# Altium schematic sheet Power.SchDoc
size A3; SheetNumber: 13; SheetTotal: 13
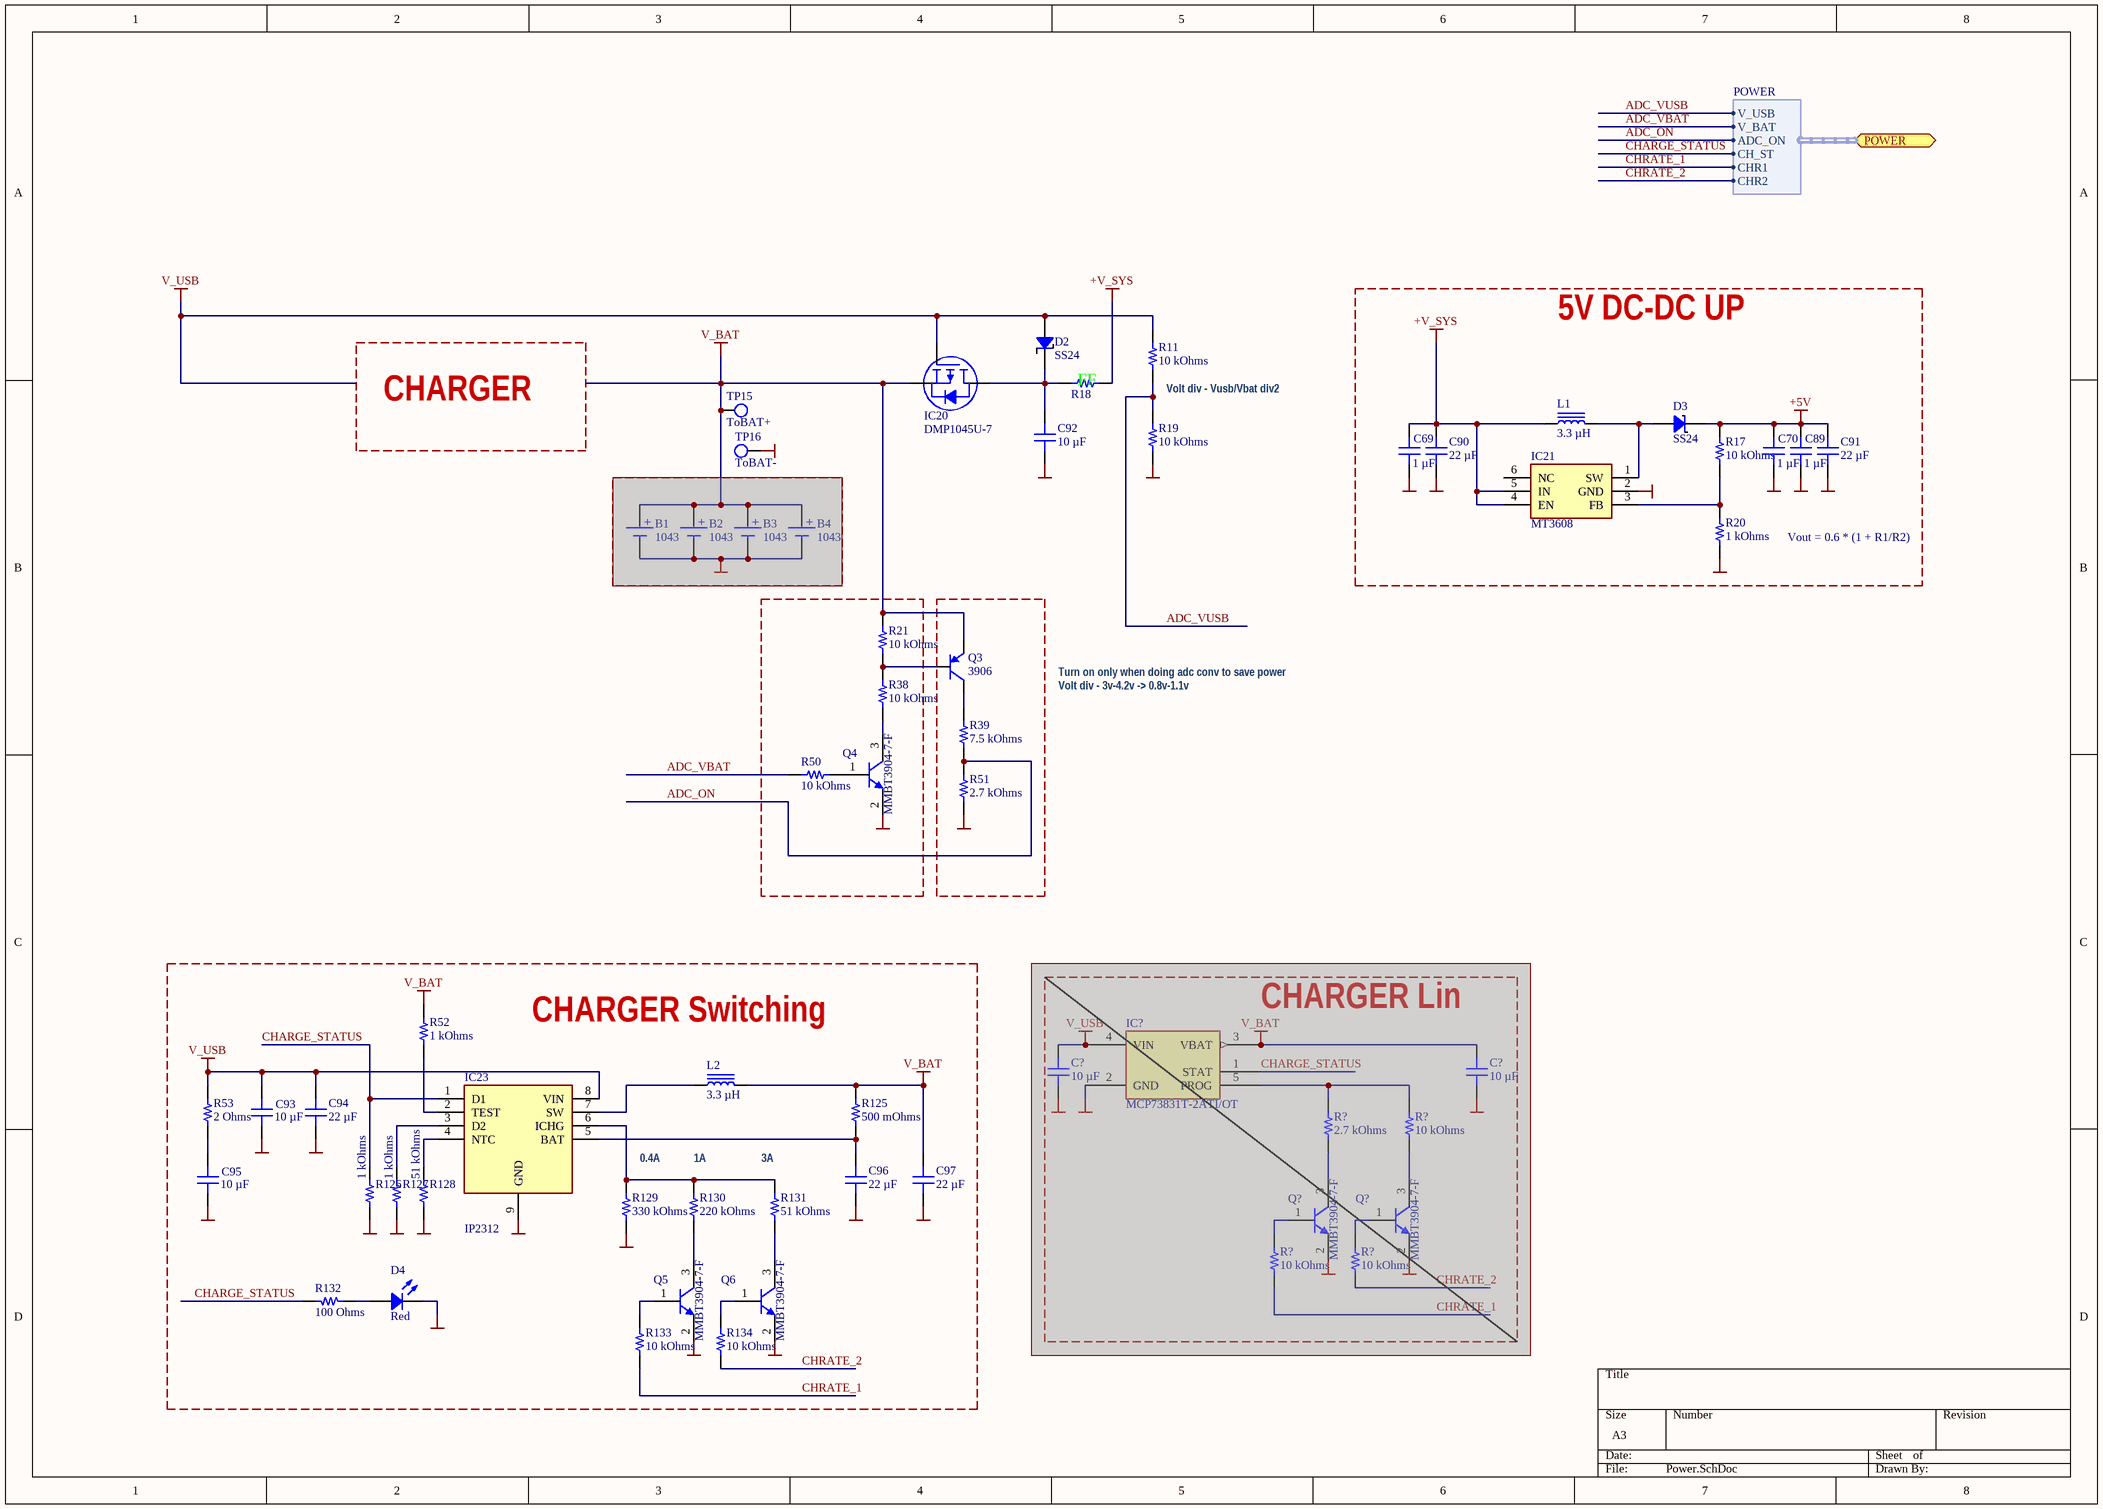
[diagram p0: Power.SchDoc]

## Parts
(Parts that share a designator on the sheet are numbered #1, #2 ... from top to bottom, then left to right.)
B1  1043  [KEYSTONE 1043]  (masked out: inside a compile mask, not in the netlist)
B2  1043  [KEYSTONE 1043]  (masked out: inside a compile mask, not in the netlist)
B3  1043  [KEYSTONE 1043]  (masked out: inside a compile mask, not in the netlist)
B4  1043  [KEYSTONE 1043]  (masked out: inside a compile mask, not in the netlist)
C69  1 µF  [CAP 0805_2012]
C70  1 µF  [CAP 0805_2012]
C89  1 µF  [CAP 0805_2012]
C90  22 µF  [CAP 0805_2012]
C91  22 µF  [CAP 0805_2012]
C92  10 µF  [CAP 0805_2012]
C93  10 µF  [CAP 0805_2012]
C94  22 µF  [CAP 0805_2012]
C95  10 µF  [CAP 0805_2012]
C96  22 µF  [CAP 0805_2012]
C97  22 µF  [CAP 0805_2012]
C?#1  10 µF  [CAP 0805_2012]  (masked out: inside a compile mask, not in the netlist)
C?#2  10 µF  [CAP 0805_2012]  (masked out: inside a compile mask, not in the netlist)
D2  SS24  [DO214AA SMB]
D3  SS24  [DO214AA SMB]
D4  Red  [LED 0805_2012 RED]
IC20  DMP1045U-7  [DIODES SOT-23-3]
IC21  MT3608  [SOT95P280X145-6N]
IC23  IP2312  [SOIC127P600X165-9N]
IC?  MCP73831T-2ATI/OT  [MICROCHIP SOT-23-5 OT]  (masked out: inside a compile mask, not in the netlist)
L1  3.3 µH  [BOURNS SRR6028]
L2  3.3 µH  [BOURNS SRR6028]
Q3  3906  [SOT-23]
Q4  MMBT3904-7-F  [DIODES SOT-23-3]
Q5  MMBT3904-7-F  [DIODES SOT-23-3]
Q6  MMBT3904-7-F  [DIODES SOT-23-3]
Q?#1  MMBT3904-7-F  [DIODES SOT-23-3]  (masked out: inside a compile mask, not in the netlist)
Q?#2  MMBT3904-7-F  [DIODES SOT-23-3]  (masked out: inside a compile mask, not in the netlist)
R11  10 kOhms  [RES 0603_1608]
R17  10 kOhms  [RES 0603_1608]
R18  (no value)  [RES 0603_1608]
R19  10 kOhms  [RES 0603_1608]
R20  1 kOhms  [RES 0603_1608]
R21  10 kOhms  [RES 0603_1608]
R38  10 kOhms  [RES 0603_1608]
R39  7.5 kOhms  [RES 0603_1608]
R50  10 kOhms  [RES 0603_1608]
R51  2.7 kOhms  [RES 0603_1608]
R52  1 kOhms  [RES 0603_1608]
R53  2 Ohms  [RES 0603_1608]
R125  500 mOhms  [RES 0603_1608]
R126  value 1 kOhms  [RES 0603_1608]
R127  1 kOhms  [RES 0603_1608]
R128  51 kOhms  [RES 0603_1608]
R129  330 kOhms  [RES 0603_1608]
R130  220 kOhms  [RES 0603_1608]
R131  51 kOhms  [RES 0603_1608]
R132  100 Ohms  [RES 0402_1005]
R133  10 kOhms  [RES 0603_1608]
R134  10 kOhms  [RES 0603_1608]
R?#1  2.7 kOhms  [RES 0603_1608]  (masked out: inside a compile mask, not in the netlist)
R?#2  10 kOhms  [RES 0603_1608]  (masked out: inside a compile mask, not in the netlist)
R?#3  10 kOhms  [RES 0603_1608]  (masked out: inside a compile mask, not in the netlist)
R?#4  10 kOhms  [RES 0603_1608]  (masked out: inside a compile mask, not in the netlist)
TP15  ToBAT+  [TESTPOINT_PAD]
TP16  ToBAT-  [TESTPOINT_PAD]

## Blocks framed on the sheet
5V DC-DC UP: C69 C70 C89-C91 D3 IC21 L1 R17 R20
CHARGER Switching: C93-C97 D4 IC23 L2 Q5 Q6 R52 R53 R125-R134
CHARGER Lin: C?#1 C?#2 IC? Q?#1 Q?#2 R?#1-R?#4

## Ports
POWER (bidir, harness POWER)

## Harnesses
POWER: V_USB, V_BAT, ADC_ON, CH_ST, CHR1, CHR2

## Nets
+5V: C70.2 C89.2 C91.2 D3.2 R17.2
+V_SYS: C69.2 C90.2 IC21.4(EN) IC21.5(IN) L1.1 R18.1
GND: C69.1 C70.1 C89.1 C90.1 C91.1 C92.1 C93.1 C94.1 C95.1 C96.1 C97.1 D4.2 IC21.2(GND) IC23.9(GND) Q4.2(E) Q5.2(E) Q6.2(E) R19.1 R20.1 R51.1 R126.2 R127.2 R128.1 R129.1 TP16.1
V_BAT: C97.2 IC20.2(S) L2.2 Q3.2(E) R21.2 R52.2 R125.2 TP15.1
V_USB: C93.2 C94.2 D2.1 IC20.1(G) IC23.8(VIN) R11.2 R53.2
ADC_ON: R39.1 R51.2 ; port POWER.ADC_ON
ADC_VBAT: R50.2 ; port POWER.V_BAT
ADC_VUSB: R11.1 R19.2 ; port POWER.V_USB
CHARGE_STATUS: IC23.1(D1) R126.1 R132.2 ; port POWER.CH_ST
CHRATE_1: R133.1 ; port POWER.CHR1
CHRATE_2: R134.1 ; port POWER.CHR2
NetC92_2: C92.2 D2.2 IC20.3(D) R18.2
NetC95_2: C95.2 R53.1
NetC96_2: C96.2 IC23.5(BAT) R125.1
NetD3_1: D3.1 IC21.1(SW) L1.2
NetD4_1: D4.1 R132.1
NetIC21_3: IC21.3(FB) R17.1 R20.2
NetIC23_2: IC23.2(TEST) R52.1
NetIC23_3: IC23.3(D2) R127.1
NetIC23_4: IC23.4(NTC) R128.2
NetIC23_6: IC23.6(ICHG) R129.2 R130.2 R131.2
NetIC23_7: IC23.7(SW) L2.1
NetQ3_1: Q3.1(B) R21.1 R38.2
NetQ3_3: Q3.3(C) R39.2
NetQ4_1: Q4.1(B) R50.1
NetQ4_3: Q4.3(C) R38.1
NetQ5_1: Q5.1(B) R133.2
NetQ5_3: Q5.3(C) R130.1
NetQ6_1: Q6.1(B) R134.2
NetQ6_3: Q6.3(C) R131.1

Not connected (* = marked no-connect by the designer): IC21 6(NC)

## Notes on the sheet
- CHARGER
- (near R18) FF
- Volt div - Vusb/Vbat div2
- Vout = 0.6 * (1 + R1/R2)
- Turn on only when doing adc conv to save power
- Volt div - 3v-4.2v -> 0.8v-1.1v
- 0.4A
- (near R130) 1A
- (near R131) 3A

## Library data of the parts
B1-B4 = 1043: BATTERY HOLDER 18650 PC PIN; Manufacturer: Keystone Electronics; Battery Cell Size: 18650; Battery Type, Function: Cylindrical, Holder; Number of Cells: 1; Style: Holder (Open); Part Number: 1043; ComponentLink1Description: Datasheet; ComponentLink1URL: http://keyelco.com/userAssets/file/M65p27.pdf; ComponentLink2Description: DigiKey Link; ComponentLink2URL: http://digikey.com/product-detail/en/keystone-electronics/1043/36-1043-ND/2745669; Height Above Board: 0.585" (14.86mm); LastUpdated: 2/2/2020 9:19:56 AM; Lifecycle Status: Active; Minimum Order: 1; Mounting Type: PCB, Through Hole; Operating Temperature: -50°C ~ 145°C; Packaging: Unknown; PartId: 2; Part Status: Active; Price: 2.58; Series: -; Supplier 1: DigiKey; Supplier Part Number 1: 36-1043-ND; Termination Style: PC Pin
C69 C70 C89 = C0805C105K4RAC7800: CAP CER 1UF 16V X7R 0805; manufacturer: KEMET; Tolerance: ±10%; Part Number: C0805C105K4RAC7800; Value: 1 µF; Applications: Bypass, Decoupling; Capacitance: 1 µF; componentlink1description: Datasheet; componentlink1url: https://api.kemet.com/component-edge/download/datasheet/C0805C105K4RACTU.pdf; componentlink2description: DigiKey Link; componentlink2url: https://www.digikey.com/en/products/detail/kemet/C0805C105K4RAC7800/416047; Device Package: 0805 (2012 Metric); lastupdated: 9/19/2022 1:03:30 PM; Lifecycle Status: Active; Minimum Order: 1; Mounting Type: Surface Mount, MLCC; Operating Temperature: -55°C ~ 125°C; Package / Case: 0805 (2012 Metric); packaging: TapeAndReel; partid: 32075; Part Status: Active; price: 0.01; series: SMD Comm X7R; Size / Dimension: 0.079" L x 0.049" W (2.00mm x 1.25mm); Supplier 1: DigiKey; Supplier Part Number 1: 399-C0805C105K4RAC7800CT-ND; Temperature Coefficient: X7R; Thickness (Max): 0.039" (1.00mm); Voltage - Rated: 16V
C90 C91 C94 C96 C97 = CC0805MKX5R8BB226: CAP CER 22UF 25V X5R 0805; manufacturer: Yageo; Tolerance: ±20%; Part Number: CC0805MKX5R8BB226; Value: 22 µF; Applications: General Purpose; Capacitance: 22 µF; componentlink1description: Datasheet; componentlink1url: https://www.yageo.com/upload/media/product/productsearch/datasheet/mlcc/UPY-GPHC_X5R_4V-to-50V_25.pdf; componentlink2description: DigiKey Link; componentlink2url: https://www.digikey.com/en/products/detail/yageo/CC0805MKX5R8BB226/5195309; Device Package: 0805 (2012 Metric); lastupdated: 2/9/2024 8:15:14 PM; Lifecycle Status: Active; Minimum Order: 1; Mounting Type: Surface Mount, MLCC; Operating Temperature: -55°C ~ 85°C; Package / Case: 0805 (2012 Metric); packaging: TapeAndReel; partid: 39226; Part Status: Active; price: 0.09; series: CC; Size / Dimension: 0.079" L x 0.049" W (2.00mm x 1.25mm); Supplier 1: DigiKey; Supplier Part Number 1: 311-1903-1-ND; Temperature Coefficient: X5R; Thickness (Max): 0.057" (1.45mm); Voltage - Rated: 25V
C92 C93 C95 C?#1 C?#2 = C0805C106K8PAC7800: CAP CER 10UF 10V X5R 0805; manufacturer: KEMET; Tolerance: ±10%; Part Number: C0805C106K8PAC7800; Value: 10 µF; Applications: Bypass, Decoupling; Capacitance: 10 µF; componentlink1description: Datasheet; componentlink1url: https://connect.kemet.com:7667/gateway/IntelliData-ComponentDocumentation/1.0/download/datasheet/C0805C106K8PACTU; componentlink2description: DigiKey Link; componentlink2url: https://www.digikey.com/en/products/detail/kemet/C0805C106K8PAC7800/1090830; Device Package: 0805 (2012 Metric); lastupdated: 9/14/2022 7:51:56 AM; Lifecycle Status: Active; Minimum Order: 1; Mounting Type: Surface Mount, MLCC; Operating Temperature: -55°C ~ 85°C; Package / Case: 0805 (2012 Metric); packaging: TapeAndReel; partid: 44790; Part Status: Active; price: 0.02; series: SMD Comm X5R; Size / Dimension: 0.079" L x 0.049" W (2.00mm x 1.25mm); Supplier 1: DigiKey; Supplier Part Number 1: 399-C0805C106K8PAC7800CT-ND; Temperature Coefficient: X5R; Thickness (Max): 0.055" (1.40mm); Voltage - Rated: 10V
D2 D3 = SS24: DIODE SCHOTTKY 40V 2A DO214AA; Manufacturer: ON Semiconductor; Current - Reverse Leakage @ Vr: 400µA @ 40V; Speed: Fast Recovery =< 500ns, > 200mA (Io); Voltage - Forward (Vf) (Max) @ If: 500mV @ 2A; Part Number: SS24; ComponentLink1Description: Datasheet; ComponentLink1URL: https://www.onsemi.com/pub/Collateral/SS29-D.pdf; ComponentLink2Description: DigiKey Link; ComponentLink2URL: http://digikey.com/product-detail/en/on-semiconductor/SS24/SS24FSCT-ND/1626273; Current - Average Rectified (Io): 2A; Diode Type: Schottky; LastUpdated: 2/8/2024 9:26:46 PM; Lifecycle Status: Active; Minimum Order: 1; Mounting Type: Surface Mount; Operating Temperature - Junction: -65°C ~ 125°C; Package / Case: DO-214AA, SMB; Packaging: TapeAndReel; PartId: 1394; Part Status: Active; Price: 0.10; Series: -; Supplier 1: DigiKey; Supplier Part Number 1: SS24FSCT-ND; Supplier Device Package: DO-214AA (SMB); Voltage - DC Reverse (Vr) (Max): 40V
D4 = LSM0805412V: LED RED CLEAR 0805 SMD; Manufacturer: Visual Communications Company - VCC; Configuration: 0805; Current - Test: 20mA; Lens Color: Colorless; Lens Size: 1.40mm x 1.20mm; Lens Style: Rectangle with Flat Top; Millicandela Rating: 100mcd; Viewing Angle: 120°; Voltage - Forward (Vf) (Typ): 2V; Wavelength - Dominant: 625nm; Part Number: LSM0805412V; Color: Red; ComponentLink1Description: Datasheet; ComponentLink1URL: https://www.vcclite.com/wp-content/uploads/wpallimport/files/files/LSM0805452V-Green-Datasheet.pdf; ComponentLink2Description: DigiKey Link; ComponentLink2URL: https://www.digikey.com/en/products/detail/visual-communications-company-vcc/LSM0805412V/10229616; Device Package: 0805 (2012 Metric); Height (Max): 0.90mm; LastUpdated: 6/3/2024 8:00:06 PM; Lens Transparency: Clear; Lifecycle Status: Active; Minimum Order: 1; Mounting Type: Surface Mount; Package / Case: 0805 (2012 Metric); Packaging: TapeAndReel; PartId: 336; Part Status: Active; Price: 0.11; Series: LSM0805; Size / Dimension: 2.00mm L x 1.25mm W; Supplier 1: DigiKey; Supplier Part Number 1: 28-LSM0805412VCT-ND; Supplier Device Package: 0805; Value: Red; Wavelength - Peak: 625nm
IC20 = DMP1045U-7: MOSFET P-CH 12V 4A SOT23; Manufacturer: Diodes Incorporated; Current - Continuous Drain (Id) @ 25°C: 4A (Ta); Drive Voltage (Max Rds On,  Min Rds On): 1.8V, 4.5V; FET Type: P-Channel; Gate Charge (Qg) (Max) @ Vgs: 15.8 nC @ 4.5 V; Input Capacitance (Ciss) (Max) @ Vds: 1357 pF @ 10 V; Power Dissipation (Max): 800mW (Ta); Rds On (Max) @ Id, Vgs: 31mOhm @ 4A, 4.5V; Vgs (Max): ±8V; Vgs(th) (Max) @ Id: 1V @ 250µA; Part Number: DMP1045U-7; ComponentLink1Description: Datasheet; ComponentLink1URL: https://www.diodes.com/assets/Datasheets/DMP1045U.pdf; ComponentLink2Description: DigiKey Link; ComponentLink2URL: https://www.digikey.com/en/products/detail/diodes-incorporated/DMP1045U-7/4249936; Drain to Source Voltage (Vdss): 12 V; LastUpdated: 2/8/2024 9:46:13 PM; Lifecycle Status: Active; Minimum Order: 1; Mounting Type: Surface Mount; Operating Temperature: -55°C ~ 150°C (TJ); Package / Case: TO-236-3, SC-59, SOT-23-3; Packaging: TapeAndReel; Part Status: Active; Price: 0.07; Series: -; Supplier 1: DigiKey; Supplier Part Number 1: DMP1045U-7DICT-ND; Supplier Device Package: SOT-23-3; Technology: MOSFET (Metal Oxide)
IC21 = MT3608: Integrated Circuit; Manufacturer_Name: Aerosemi; Datasheet Link: https://www.olimex.com/Products/Breadboarding/BB-PWR-3608/resources/MT3608.pdf; Height: 1.45mm; Manufacturer_Part_Number: MT3608
IC23 = IP2312: Integrated Circuit; Manufacturer_Name: INJOINIC; Datasheet Link: http://www.injoinic.com/wwwroot/uploads/files/20230913/623558e526750db62e25e32800f94a6b.pdf; Height: 1.65mm; Manufacturer_Part_Number: IP2312
IC? = MCP73831T-2ATI/OT: IC CONTROLLR LI-ION 4.2V SOT23-5; Manufacturer: Microchip Technology; Battery Chemistry: Lithium Ion/Polymer; Charge Current - Max: 500mA; Current - Charging: Constant - Programmable; Fault Protection: Over Voltage; Number of Cells: 1; Programmable Features: Current; Voltage - Supply (Max): 6V; Part Number: MCP73831T-2ATI/OT; Battery Pack Voltage: 4.2V; ComponentLink1Description: Datasheet; ComponentLink1URL: http://ww1.microchip.com/downloads/en/DeviceDoc/20001984g.pdf; ComponentLink2Description: DigiKey Link; ComponentLink2URL: //digikey.com/product-detail/en/microchip-technology/MCP73831T-2ATI-OT/MCP73831T-2ATI-OTTR-ND/964303; Device Package: SC-74A, SOT-753; LastUpdated: 12/3/2019 11:33:03 PM; Lifecycle Status: 0; Minimum Order: 1; Mounting Type: Surface Mount; Operating Temperature: -40°C ~ 85°C (TA); Package / Case: SC-74A, SOT-753; Packaging: TapeAndReel; PartId: 1; Part Status: Active; Price: 0.42; Series: -; Supplier 1: DigiKey; Supplier Part Number 1: MCP73831T-2ATI/OTTR-ND; Supplier Device Package: SOT-23-5
L1 L2 = SRR6028-3R3Y: FIXED IND 3.3UH 2.5A 28 MOHM SMD; Manufacturer: Bourns Inc.; Current - Saturation: 2.6A; DC Resistance (DCR): 28mOhm Max; Frequency - Self Resonant: 45MHz; Inductance Frequency - Test: 100 kHz; Material - Core: Ferrite; Q @ Freq: 10 @ 7.96MHz; Shielding: Shielded; Tolerance: ±30%; Type: Drum Core, Wirewound; Part Number: SRR6028-3R3Y; ComponentLink1Description: Datasheet; ComponentLink1URL: https://www.bourns.com/docs/Product-Datasheets/SRR6028.pdf; ComponentLink2Description: DigiKey Link; ComponentLink2URL: https://www.digikey.com/en/products/detail/bourns-inc/SRR6028-3R3Y/1970369; Current Rating (Amps): 2.5 A; Device Package: Nonstandard; Height - Seated (Max): 0.118" (3.00mm); Inductance: 3.3 µH; LastUpdated: 2/8/2024 9:34:55 PM; Lifecycle Status: Active; Minimum Order: 1; Mounting Type: Surface Mount; Operating Temperature: -40°C ~ 125°C; Package / Case: Nonstandard; Packaging: TapeAndReel; PartId: 57; Part Status: Active; Price: 0.31; Series: SRR6028; Size / Dimension: 0.268" L x 0.268" W (6.80mm x 6.80mm); Supplier 1: DigiKey; Supplier Part Number 1: 118-SRR6028-3R3YCT-ND; Value: 3.3 µH
Q3 = MMBT3906
Q4-Q6 Q?#1 Q?#2 = MMBT3904-7-F: TRANS NPN 40V 0.2A SOT23-3; Manufacturer: Diodes Incorporated; Current - Collector Cutoff (Max): 50nA (ICBO); Current - Collector (Ic) (Max): 200 mA; DC Current Gain (hFE) (Min) @ Ic, Vce: 100 @ 10mA, 1V; Frequency - Transition: 300MHz; Power - Max: 300 mW; Vce Saturation (Max) @ Ib, Ic: 300mV @ 5mA, 50mA; Part Number: MMBT3904-7-F; ComponentLink1Description: Datasheet; ComponentLink1URL: https://www.diodes.com/assets/Datasheets/ds30036.pdf; ComponentLink2Description: DigiKey Link; ComponentLink2URL: https://www.digikey.com/en/products/detail/diodes-incorporated/MMBT3904-7-F/814494; LastUpdated: 2/8/2024 9:54:04 PM; Lifecycle Status: Active; Minimum Order: 1; Mounting Type: Surface Mount; Operating Temperature: -55°C ~ 150°C (TJ); Package / Case: TO-236-3, SC-59, SOT-23-3; Packaging: TapeAndReel; PartId: 85; Part Status: Active; Price: 0.01; Series: -; Supplier 1: DigiKey; Supplier Part Number 1: MMBT3904-FDICT-ND; Supplier Device Package: SOT-23-3; Transistor Type: NPN; Voltage - Collector Emitter Breakdown (Max): 40 V
R11 R17 R19 R21 R38 R50 R133 R134 = ERJ-3EKF1002V: RES SMD 10K OHM 1% 1/10W 0603; Manufacturer: Panasonic Electronic Components; Power (Watts): 0.1W, 1/10W; Temperature Coefficient: ±100ppm/°C; Part Number: ERJ-3EKF1002V; Value: 10 kOhms; ComponentLink1Description: Datasheet; ComponentLink1URL: https://industrial.panasonic.com/cdbs/www-data/pdf/RDA0000/AOA0000C304.pdf; ComponentLink2Description: DigiKey Link; ComponentLink2URL: https://www.digikey.com/en/products/detail/panasonic-electronic-components/ERJ-3EKF1002V/196066; Composition: Thick Film; Device Package: 0603 (1608 Metric); Height - Seated (Max): 0.022" (0.55mm); LastUpdated: 2/9/2024 8:41:59 PM; Lifecycle Status: Active; Minimum Order: 1; Number of Terminations: 2; Operating Temperature: -55°C ~ 155°C; Package / Case: 0603 (1608 Metric); Packaging: TapeAndReel; PartId: 25695; Part Status: Active; Price: 0.01; Resistance: 10 kOhms; Series: ERJ-3EK; Size / Dimension: 0.063" L x 0.031" W (1.60mm x 0.80mm); Supplier 1: DigiKey; Supplier Part Number 1: P10.0KHCT-ND; Supplier Device Package: 0603; Tolerance: ±1%; Features: Automotive AEC-Q200; Ratings: AEC-Q200
R18 = RCA06030000ZSEA: RES SMD 0 OHM JUMPER 1/10W 0603; Manufacturer: Vishay Dale; Power (Watts): 0.1W, 1/10W; Part Number: RCA06030000ZSEA; ComponentLink1Description: Datasheet; ComponentLink1URL: http://www.vishay.com/docs/20037/rcae3.pdf; ComponentLink2Description: DigiKey Link; ComponentLink2URL: http://digikey.com/product-detail/en/vishay-dale/RCA06030000ZSEA/541-2192-1-ND/4946845; Composition: Thick Film; Device Package: 0603 (1608 Metric); Features: Anti-Sulfur, Automotive AEC-Q200; Height - Seated (Max): 0.020" (0.50mm); LastUpdated: 9/2/2020 1:10:23 AM; Lifecycle Status: Active; Minimum Order: 1; Number of Terminations: 2; Operating Temperature: -55°C ~ 155°C; Package / Case: 0603 (1608 Metric); Packaging: TapeAndReel; PartId: 5740; Part Status: Active; Price: 0.01; Ratings: AEC-Q200; Series: RCA; Size / Dimension: 0.061" L x 0.033" W (1.55mm x 0.85mm); Supplier 1: DigiKey; Supplier Part Number 1: 541-2192-1-ND; Supplier Device Package: 0603; Tolerance: Jumper
R20 R52 R126 R127 = CRCW06031K00FKEB: RES SMD 1K OHM 1% 1/10W 0603; Manufacturer: Vishay Dale; Power (Watts): 0.1W, 1/10W; Temperature Coefficient: ±100ppm/°C; Part Number: CRCW06031K00FKEB; ComponentLink1Description: Datasheet; ComponentLink1URL: http://www.vishay.com/docs/20035/dcrcwe3.pdf; ComponentLink2Description: DigiKey Link; ComponentLink2URL: https://www.digikey.com/en/products/detail/vishay-dale/CRCW06031K00FKEB/5071169; Composition: Thick Film; Device Package: 0603 (1608 Metric); Features: Automotive AEC-Q200; Height - Seated (Max): 0.020" (0.50mm); LastUpdated: 2/9/2024 8:43:36 PM; Lifecycle Status: Active; Minimum Order: 1; Number of Terminations: 2; Operating Temperature: -55°C ~ 155°C; Package / Case: 0603 (1608 Metric); Packaging: CutTape; PartId: 5123; Part Status: Active; Price: 0.01; Ratings: AEC-Q200; Resistance: 1 kOhms; Series: CRCW; Size / Dimension: 0.063" L x 0.033" W (1.60mm x 0.85mm); Supplier 1: DigiKey; Supplier Part Number 1: 541-2985-1-ND; Supplier Device Package: 0603; Tolerance: ±1%
  R20 R52 R127: Value: 1 kOhms
R39 = ERJ-U03F7501V: RES 7.5K OHM 1% 1/10W 0603 SMD; Manufacturer: Panasonic Electronic Components; Power (Watts): 0.1W, 1/10W; Temperature Coefficient: ±100ppm/°C; Part Number: ERJ-U03F7501V; Value: 7.5 kOhms; ComponentLink1Description: Datasheet; ComponentLink1URL: https://industrial.panasonic.com/cdbs/www-data/pdf/RDP0000/AOA0000C334.pdf; ComponentLink2Description: DigiKey Link; ComponentLink2URL: https://www.digikey.com/en/products/detail/panasonic-electronic-components/ERJ-U03F7501V/11625704; Composition: Thick Film; Device Package: 0603 (1608 Metric); Features: Anti-Sulfur, Automotive AEC-Q200; Height - Seated (Max): 0.022" (0.55mm); LastUpdated: 2/9/2024 8:41:38 PM; Lifecycle Status: Active; Minimum Order: 1; Number of Terminations: 2; Operating Temperature: -55°C ~ 155°C; Package / Case: 0603 (1608 Metric); Packaging: TapeAndReel; PartId: 63936; Part Status: Active; Price: 0.01; Resistance: 7.5 kOhms; Series: ERJ-U03; Size / Dimension: 0.063" L x 0.031" W (1.60mm x 0.80mm); Supplier 1: DigiKey; Supplier Part Number 1: 10-ERJ-U03F7501VCT-ND; Supplier Device Package: 0603; Tolerance: ±1%; Ratings: AEC-Q200
R51 R?#1 = CRCW06032K70FKEAC: RES 2.7K OHM 1% 1/10W 0603; Manufacturer: Vishay Dale; Power (Watts): 0.1W, 1/10W; Temperature Coefficient: ±100ppm/°C; Part Number: CRCW06032K70FKEAC; Value: 2.7 kOhms; ComponentLink1Description: Datasheet; ComponentLink1URL: http://www.vishay.com/docs/28773/crcwce3.pdf; ComponentLink2Description: DigiKey Link; ComponentLink2URL: https://www.digikey.com/en/products/detail/vishay-dale/CRCW06032K70FKEAC/7924071; Composition: Thick Film; Device Package: 0603 (1608 Metric); Height - Seated (Max): 0.022" (0.55mm); LastUpdated: 2/9/2024 8:41:45 PM; Lifecycle Status: Active; Minimum Order: 1; Number of Terminations: 2; Operating Temperature: -55°C ~ 155°C; Package / Case: 0603 (1608 Metric); Packaging: TapeAndReel; PartId: 56540; Part Status: Active; Price: 0.01; Resistance: 2.7 kOhms; Series: CRCW-C; Size / Dimension: 0.063" L x 0.031" W (1.60mm x 0.80mm); Supplier 1: DigiKey; Supplier Part Number 1: 541-5328-1-ND; Supplier Device Package: 0603; Tolerance: ±1%
R53 = ERJ-U03F2R00V: RES 2 OHM 1% 1/10W 0603 SMD; Manufacturer: Panasonic Electronic Components; Power (Watts): 0.1W, 1/10W; Temperature Coefficient: -100/ +600ppm/°C; Part Number: ERJ-U03F2R00V; Value: 2 Ohms; ComponentLink1Description: Datasheet; ComponentLink1URL: https://industrial.panasonic.com/cdbs/www-data/pdf/RDP0000/AOA0000C334.pdf; ComponentLink2Description: DigiKey Link; ComponentLink2URL: https://www.digikey.com/en/products/detail/panasonic-electronic-components/ERJ-U03F2R00V/11636045; Composition: Thick Film; Device Package: 0603 (1608 Metric); Features: Anti-Sulfur, Automotive AEC-Q200; Height - Seated (Max): 0.022" (0.55mm); LastUpdated: 2/9/2024 8:41:34 PM; Lifecycle Status: Active; Minimum Order: 1; Number of Terminations: 2; Operating Temperature: -55°C ~ 155°C; Package / Case: 0603 (1608 Metric); Packaging: TapeAndReel; PartId: 63339; Part Status: Active; Price: 0.01; Resistance: 2 Ohms; Series: ERJ-U03; Size / Dimension: 0.063" L x 0.031" W (1.60mm x 0.80mm); Supplier 1: DigiKey; Supplier Part Number 1: 10-ERJ-U03F2R00VCT-ND; Supplier Device Package: 0603; Tolerance: ±1%; Ratings: AEC-Q200
R125 = RLT0816-C-R500-FNH: RES 0.5 OHM 1% 1/10W 0603; Manufacturer: Delta Electronics/Cyntec; Power (Watts): 0.1W, 1/10W; Temperature Coefficient: ±200ppm/°C; Part Number: RLT0816-C-R500-FNH; Value: 500 mOhms; ComponentLink2Description: DigiKey Link; ComponentLink2URL: https://www.digikey.com/en/products/detail/delta-electronics-cyntec/RLT0816-C-R500-FNH/9762162; Composition: Thick Film; Device Package: 0603 (1608 Metric); Height - Seated (Max): 0.022" (0.55mm); LastUpdated: 2/9/2024 8:41:44 PM; Lifecycle Status: Active; Minimum Order: 1; Number of Terminations: 2; Operating Temperature: -55°C ~ 125°C; Package / Case: 0603 (1608 Metric); Packaging: TapeAndReel; PartId: 56414; Part Status: Active; Price: 0.11; Resistance: 500 mOhms; Series: RLT0816; Size / Dimension: 0.063" L x 0.031" W (1.60mm x 0.80mm); Supplier 1: DigiKey; Supplier Part Number 1: 2037-RLT0816-C-R500-FNHCT-ND; Supplier Device Package: 0603; Tolerance: ±1%
R128 R131 = RMCF0603FT51K0: RES 51K OHM 1% 1/10W 0603; Manufacturer: Stackpole Electronics Inc; Power (Watts): 0.1W, 1/10W; Temperature Coefficient: ±100ppm/°C; Part Number: RMCF0603FT51K0; Value: 51 kOhms; ComponentLink1Description: Datasheet; ComponentLink1URL: https://www.seielect.com/catalog/sei-rmcf_rmcp.pdf; ComponentLink2Description: DigiKey Link; ComponentLink2URL: https://www.digikey.com/en/products/detail/stackpole-electronics-inc/RMCF0603FT51K0/1760867; Composition: Thick Film; Device Package: 0603 (1608 Metric); Features: Automotive AEC-Q200; Height - Seated (Max): 0.022" (0.55mm); LastUpdated: 2/9/2024 8:43:14 PM; Lifecycle Status: Active; Minimum Order: 1; Number of Terminations: 2; Operating Temperature: -55°C ~ 155°C; Package / Case: 0603 (1608 Metric); Packaging: CutTape; PartId: 10630; Part Status: Active; Price: 0.01; Resistance: 51 kOhms; Series: RMCF; Size / Dimension: 0.061" L x 0.031" W (1.55mm x 0.80mm); Supplier 1: DigiKey; Supplier Part Number 1: RMCF0603FT51K0CT-ND; Supplier Device Package: 0603; Tolerance: ±1%; Ratings: AEC-Q200
R129 = RMCF0603JG330K: RES 330K OHM 5% 1/10W 0603; Manufacturer: Stackpole Electronics Inc; Power (Watts): 0.1W, 1/10W; Temperature Coefficient: ±200ppm/°C; Part Number: RMCF0603JG330K; Value: 330 kOhms; ComponentLink1Description: Datasheet; ComponentLink1URL: https://www.seielect.com/catalog/sei-packaging.pdf; ComponentLink2Description: DigiKey Link; ComponentLink2URL: https://www.digikey.com/en/products/detail/stackpole-electronics-inc/RMCF0603JG330K/6053782; Composition: Thick Film; Device Package: 0603 (1608 Metric); Features: Automotive AEC-Q200; Height - Seated (Max): 0.022" (0.55mm); LastUpdated: 2/9/2024 8:42:36 PM; Lifecycle Status: Active; Minimum Order: 1; Number of Terminations: 2; Operating Temperature: -55°C ~ 155°C; Package / Case: 0603 (1608 Metric); Packaging: CutTape; PartId: 20312; Part Status: Active; Price: 0.01; Ratings: AEC-Q200; Resistance: 330 kOhms; Series: RMCF; Size / Dimension: 0.061" L x 0.031" W (1.55mm x 0.80mm); Supplier 1: DigiKey; Supplier Part Number 1: RMCF0603JG330KCT-ND; Supplier Device Package: 0603; Tolerance: ±5%
R130 = CRCW0603220KFKEAC: RES 220K OHM 1% 1/10W 0603; Manufacturer: Vishay Dale; Power (Watts): 0.1W, 1/10W; Temperature Coefficient: ±100ppm/°C; Part Number: CRCW0603220KFKEAC; Value: 220 kOhms; ComponentLink1Description: Datasheet; ComponentLink1URL: http://www.vishay.com/docs/28773/crcwce3.pdf; ComponentLink2Description: DigiKey Link; ComponentLink2URL: https://www.digikey.com/en/products/detail/vishay-dale/CRCW0603220KFKEAC/7928461; Composition: Thick Film; Device Package: 0603 (1608 Metric); Height - Seated (Max): 0.022" (0.55mm); LastUpdated: 2/9/2024 8:41:57 PM; Lifecycle Status: Active; Minimum Order: 1; Number of Terminations: 2; Operating Temperature: -55°C ~ 155°C; Package / Case: 0603 (1608 Metric); Packaging: TapeAndReel; PartId: 25953; Part Status: Active; Price: 0.01; Resistance: 220 kOhms; Series: CRCW-C; Supplier 1: DigiKey; Supplier Part Number 1: 541-4039-1-ND; Supplier Device Package: 0603; Tolerance: ±1%
R132 = CRCW0402100RFKEE: RES SMD 100 OHM 1% 1/16W 0402; Manufacturer: Vishay Dale; Power (Watts): 0.063W, 1/16W; Temperature Coefficient: ±100ppm/°C; Part Number: CRCW0402100RFKEE; Value: 100 Ohms; ComponentLink1Description: Datasheet; ComponentLink1URL: http://www.vishay.com/docs/20035/dcrcwe3.pdf; ComponentLink2Description: DigiKey Link; ComponentLink2URL: https://www.digikey.com/en/products/detail/vishay-dale/CRCW0402100RFKEE/5069886; Composition: Thick Film; Device Package: 0402 (1005 Metric); Height - Seated (Max): 0.016" (0.40mm); LastUpdated: 2/9/2024 8:30:05 PM; Lifecycle Status: Active; Minimum Order: 1; Number of Terminations: 2; Operating Temperature: -55°C ~ 155°C; Package / Case: 0402 (1005 Metric); Packaging: CutTape; PartId: 6830; Part Status: Active; Price: 0.01; Resistance: 100 Ohms; Series: CRCW; Size / Dimension: 0.039" L x 0.020" W (1.00mm x 0.50mm); Supplier 1: DigiKey; Supplier Part Number 1: 541-2953-1-ND; Supplier Device Package: 0402; Tolerance: ±1%; Features: Automotive AEC-Q200; Ratings: AEC-Q200
R?#2-R?#4 = RT0603FRE0710KL: RES SMD 10K OHM 1% 1/10W 0603; Manufacturer: Yageo; Power (Watts): 0.1W, 1/10W; Temperature Coefficient: ±50ppm/°C; Part Number: RT0603FRE0710KL; Value: 10 kOhms; ComponentLink1Description: Datasheet; ComponentLink1URL: https://www.yageo.com/upload/media/product/productsearch/datasheet/rchip/PYu-RT_1-to-0.01_RoHS_L_11.pdf; ComponentLink2Description: DigiKey Link; ComponentLink2URL: http://digikey.com/product-detail/en/yageo/RT0603FRE0710KL/YAG2321CT-ND/5252435; Composition: Thin Film; Device Package: 0603 (1608 Metric); Height - Seated (Max): 0.022" (0.55mm); LastUpdated: 9/2/2020 1:10:23 AM; Lifecycle Status: Active; Minimum Order: 1; Number of Terminations: 2; Operating Temperature: -55°C ~ 155°C; Package / Case: 0603 (1608 Metric); Packaging: TapeAndReel; PartId: 5671; Part Status: Active; Price: 0.01; Resistance: 10 kOhms; Series: RT; Size / Dimension: 0.063" L x 0.031" W (1.60mm x 0.80mm); Supplier 1: DigiKey; Supplier Part Number 1: YAG2321CT-ND; Supplier Device Package: 0603; Tolerance: ±1%
TP15 TP16 = TestPoint